# EAGLE design FT232-Breakout-v10 (EAGLE 4.16)
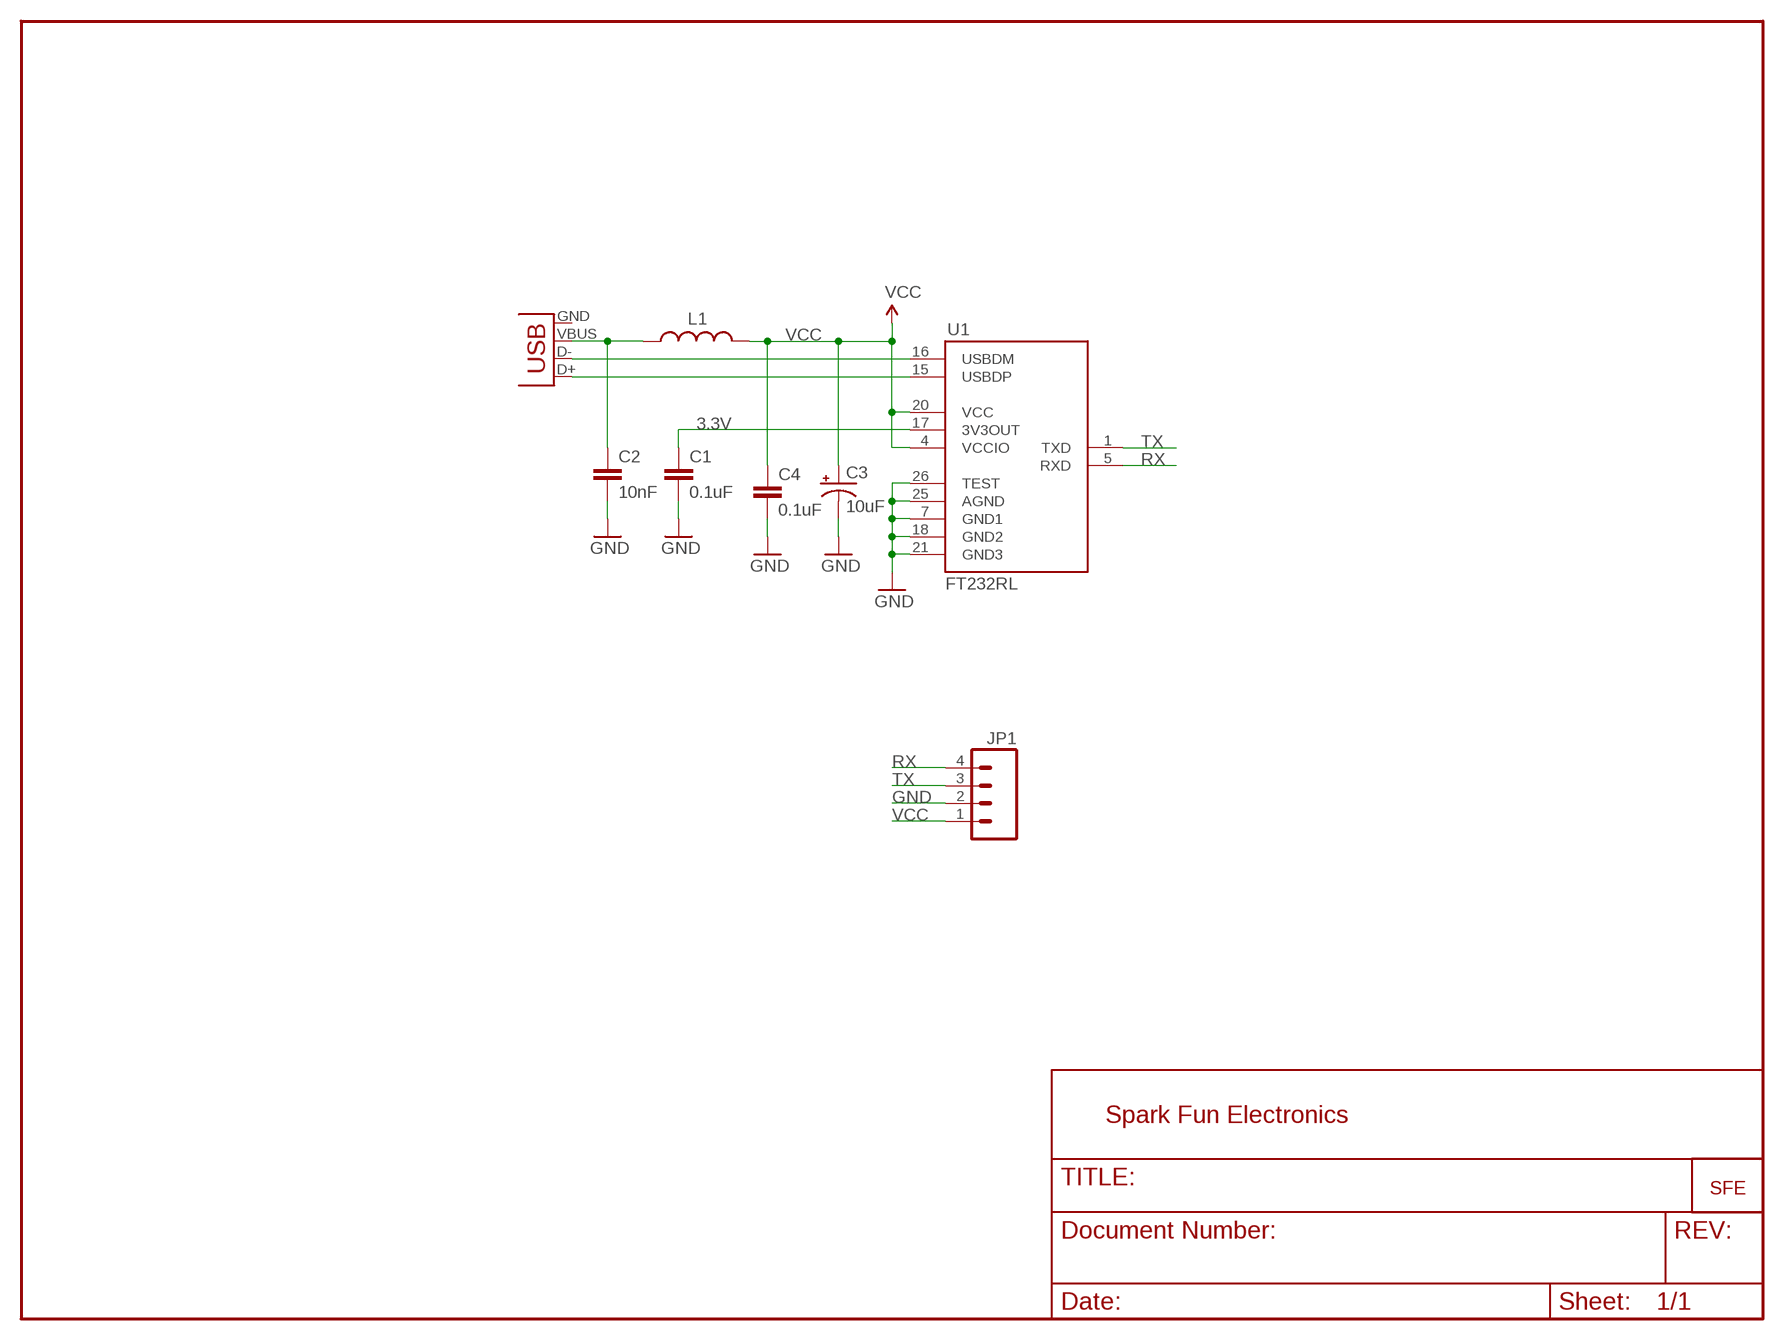
[diagram p0: schematic, sheet 1]

## Parts
C1  0.1uF  CAP0603  [0603]
C2  10nF  CAP0603  [0603]
C3  10uF  CAP_POL1206  [EIA3216]
C4  0.1uF  CAP0603  [0603]
JP1  M04PTH  [1X04]
L1  INDUCTOR0603  [0603]
U1  FT232RL  FT232RL-BASICSSOP  [SSOP28DB]
U$1  LOGO-SFE  [SFE-NEW-WEBLOGO]
X1  USB  [USB-B-PTH]

## Nets
3.3V: C1.1 U1.17(3V3OUT)
GND: C1.2 C2.2 C3.C(-) C4.2 JP1.2 U1.7(GND1) U1.18(GND2) U1.21(GND3) U1.25(AGND) U1.26(TEST)
N$1: U1.16(USBDM) X1.D-
N$2: U1.15(USBDP) X1.D+
RX: JP1.4 U1.5(RXD)
TX: JP1.3 U1.1(TXD)
VBUS: C2.1 L1.1 X1.VBUS
VCC: C3.A(+) C4.1 JP1.1 L1.2 U1.4(VCCIO) U1.20(VCC)
Unconnected: X1.GND

## Notes on the sheet
- Spark Fun Electronics

## Library data of the parts
C1 C2 C4 = SparkFun:CAP: Capacitor Standard 0603 ceramic capacitor, and 0.1" leaded capacitor.
C3 = SparkFun:CAP_POL: Capacitor Polarized These are standard SMD and PTH capacitors. Normally 10uF, 47uF, and 100uF in electrolytic and tantalum varieties. Always verify the external diameter of the through hole cap, it varies with capacity, voltage, and manufacturer. The EIA devices should be standard.
JP1 = SparkFun:M04: Header 4 Standard 4-pin 0.1" header. Use with straight break away headers (SKU : PRT-00116), right angle break away headers (PRT-00553), swiss pins (PRT-00743), machine pins (PRT-00117), and female headers (PRT-00115). Molex polarized connector foot print use with SKU : PRT-08231 with associated crimp pins and housings.
L1 = SparkFun:INDUCTOR: Inductors Basic Inductor/Choke - 0603 and 1206. Footprints are not proven and vary greatly between part numbers.
U1 = SparkFun:FT232RL-BASIC: USB UART This is the simplified version of the FT232RL unit. Only what you need, nothing you don't. Spark Fun Electronics SKU : COM-00650
U$1 = SparkFun:LOGO-SFE: Spark Fun Electronics PCB Logo This is the standard Spark Fun Electronics PCB logo.
X1 = SparkFun:USB: USB Connectors USB-B-PTH is fully proven SKU : PRT-00139 USB-miniB is fully proven SKU : PRT-00587 USB-A-H is throughly reviewed, but untested. Spark Fun Electronics SKU : PRT-00437 USB-B-SMT is throughly reviewed, but untested. Needs silkscreen touching up. USB-A-S has not been used/tested USB-MB-H has not been used/tested

## Board
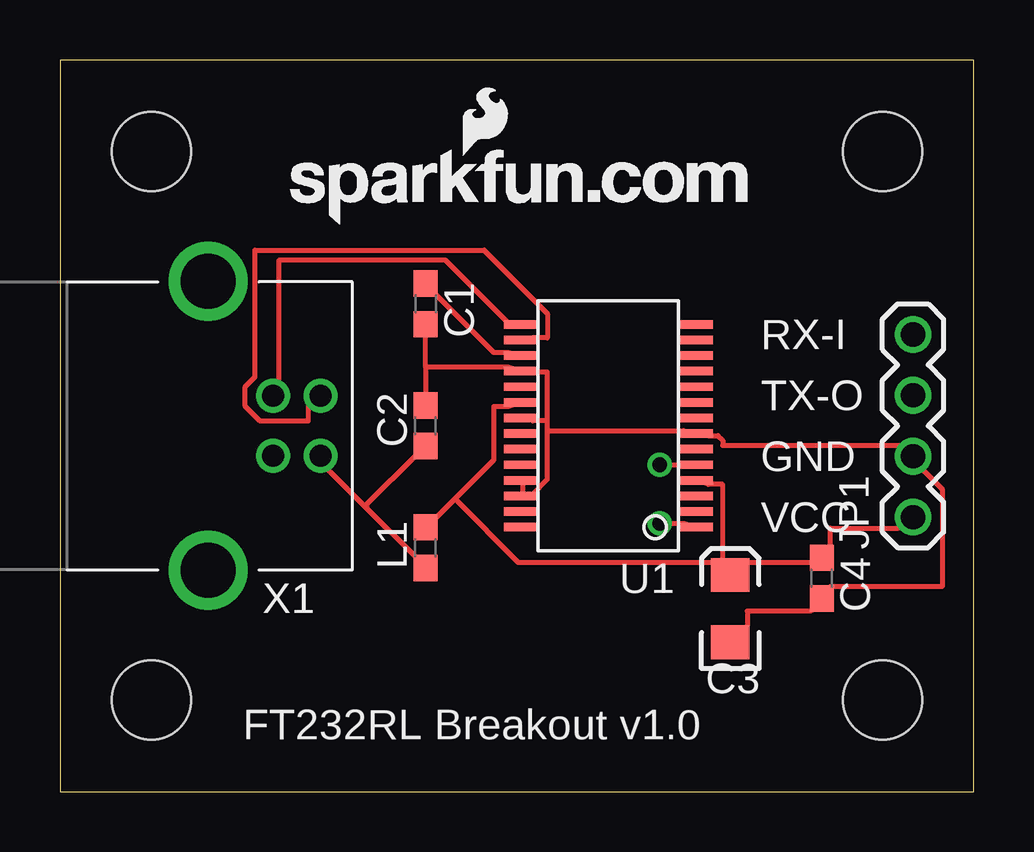
[diagram p1: board, top side]
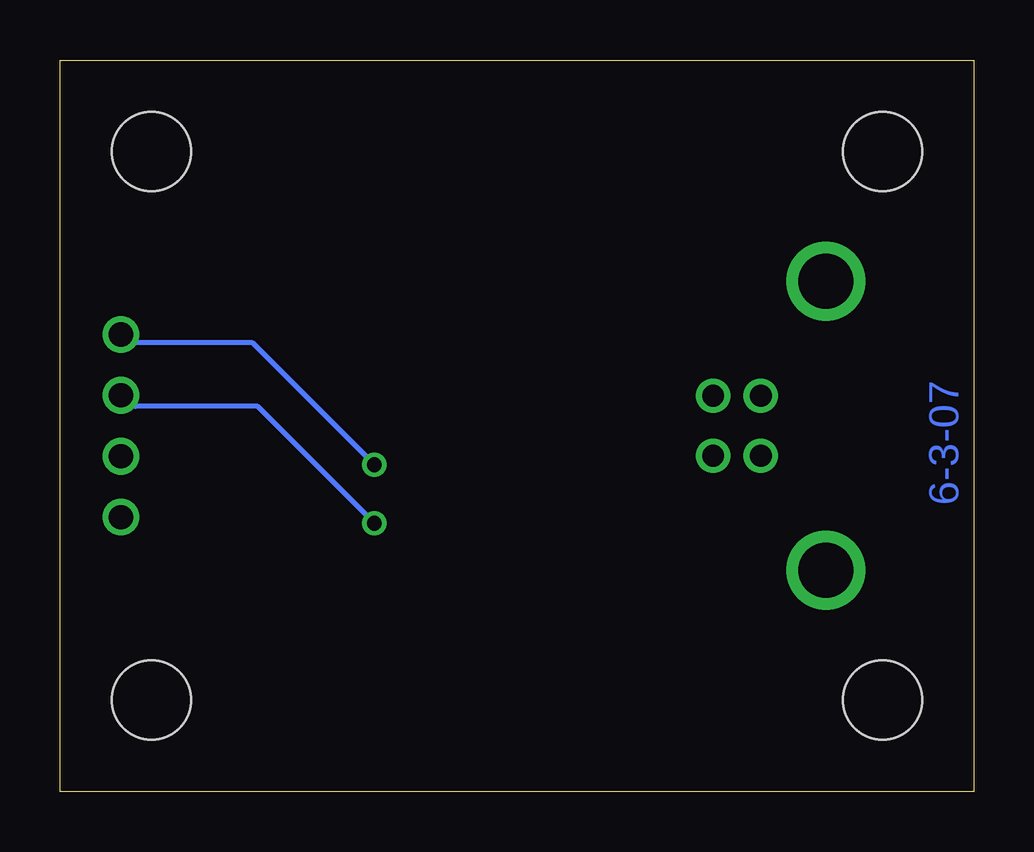
[diagram p2: board, bottom side, seen from below]

Size 38.1 x 30.48 mm. Coordinates in mm from the lower left corner, seen from the top.
Outline: 0,0 38.1,0 38.1,30.48 0,30.48 0,0
Copper layers (1*16): Top 0.035mm / dielectric 1.5mm / Bottom 0.035mm
Design rules "default": minimum track width 8mil, minimum drill 24mil, track to track 8mil, track to pad 8mil, pad to pad 8mil, via to via 8mil, smd to smd 8mil, copper to edge 40mil, drill to drill 8mil, minimum pad ring 10mil, minimum via ring 8mil, stop-mask expansion 4mil, vias tented up to drill 0mil, thermal gap 10mil
Holes 3.3 mm at 3.81,3.81 3.81,26.67 34.29,26.67 34.29,3.81
tKeepout: area 0.6,0.6 to 7,7; area 0.6,23.5 to 7,29.8; area 31.1,23.5 to 37.5,29.8; area 31.1,0.6 to 37.5,7

### Footprints (pad centres in the part's own frame; a part is rotated, then mirrored left to right if it is on the bottom)
0603 = smd 1.1 x 1: 1 -0.85,0; 2 0.85,0
EIA3216 = smd 1.4 x 1.6: A 1.4,0; C -1.4,0
1X04 = drill 1.016 round: 1 0,0; 2 2.54,0; 3 5.08,0; 4 7.62,0
SSOP28DB = smd 0.348 x 1.397: 1 -4.225,-3.656; 2 -3.575,-3.656; 3 -2.925,-3.656; 4 -2.275,-3.656; 5 -1.625,-3.656; 6 -0.975,-3.656; 7 -0.325,-3.656; 8 0.325,-3.656; 9 0.975,-3.656; 10 1.625,-3.656; 11 2.275,-3.656; 12 2.925,-3.656; 13 3.575,-3.656; 14 4.225,-3.656; 15 4.225,3.656; 16 3.575,3.656; 17 2.925,3.656; 18 2.275,3.656; 19 1.625,3.656; 20 0.975,3.656; 21 0.325,3.656; 22 -0.325,3.656; 23 -0.975,3.656; 24 -1.625,3.656; 25 -2.275,3.656; 26 -2.925,3.656; 27 -3.575,3.656; 28 -4.225,3.656
USB-B-PTH = drill 0.914 round: D+ 0,1.25; D- 1.981,1.25; GND 0,-1.25; VBUS 1.981,-1.25 | drill 2.286 round: P$1 -2.718,-6.02; P$2 -2.718,6.02

### Placement (x,y rotation side)
C1  15.24,20.32 270 top
C2  15.24,15.24 90 top
C3  27.94,7.62 90 top
C4  31.75,8.89 270 top
JP1  35.56,11.43 90 top
L1  15.24,10.16 90 top
U1  22.86,15.24 90 top
U$1  9.59,23.62 0 top
X1  8.89,15.24 0 top

### Tracks (layer width: path | path; a pad name or v marks a point on that pad's centre or on a via)
3.3V
  Top 0.203: C1.1 15.65,20.73 18.09,18.29 18.69,18.29 U1.17
GND
  Top 0.203: C3.C 28.65,6.91 28.65,7.52 31.29,7.52 C4.2 32.11,8.53 36.78,8.53 36.78,12.6 35.97,13.41 JP1.2 34.95,14.43 27.64,14.43 27.64,14.63 27.43,14.83 27.03,14.83 U1.7 26.01,15.04 20.32,15.04 | 15.24,17.68 C2.2 | 15.24,17.68 C1.2 | U1.25 19.3,12.8 19.3,12.39 U1.26 19.71,12.39 20.32,13.01 20.32,15.04 | 20.32,15.44 19.71,15.44 U1.21 | 20.32,15.04 20.32,15.44 | 20.32,15.44 20.32,17.48 19.71,17.48 U1.18 18.69,17.68 15.24,17.68
N$1
  Top 0.203: U1.16 19.71,18.9 20.32,18.9 20.32,19.91 17.68,22.55 8.13,22.55 8.13,17.27 7.72,16.87 7.72,16.05 8.33,15.44 10.36,15.44 10.36,16.05 X1.D-
N$2
  Top 0.203: U1.15 18.69,19.51 16.05,22.15 9.14,22.15 9.14,17.07 X1.D+
RX  (via drill 0.61)
  Top 0.203: v24.99,13.61 26.01,13.61 U1.5
  Bottom 0.203: v24.99,13.61 30.07,18.69 34.95,18.69 JP1.4
TX  (via drill 0.61)
  Top 0.203: v24.99,11.18 26.01,11.18 U1.1
  Bottom 0.203: v24.99,11.18 29.87,16.05 34.95,16.05 JP1.3
VBUS
  Top 0.203: 12.8,11.79 11.18,13.41 X1.VBUS | 12.8,11.79 14.83,9.75 L1.1 | 12.8,11.79 12.8,11.99 14.83,14.02 C2.1
VCC
  Top 0.203: 16.46,12.19 18.09,13.82 18.09,16.05 18.69,16.05 U1.20 | 16.46,12.19 15.65,11.38 L1.2 | C3.A 28.65,9.55 31.29,9.55 C4.1 32.11,10.16 32.11,10.97 34.95,10.97 JP1.1 | U1.4 27.03,12.8 27.64,12.8 27.64,9.55 C3.A | 16.46,12.19 19.1,9.55 27.23,9.55 C3.A

### Text on the board
Bottom: 6-3-07
tPlace: RX-I | TX-O | GND | VCC | FT232RL Breakout v1.0